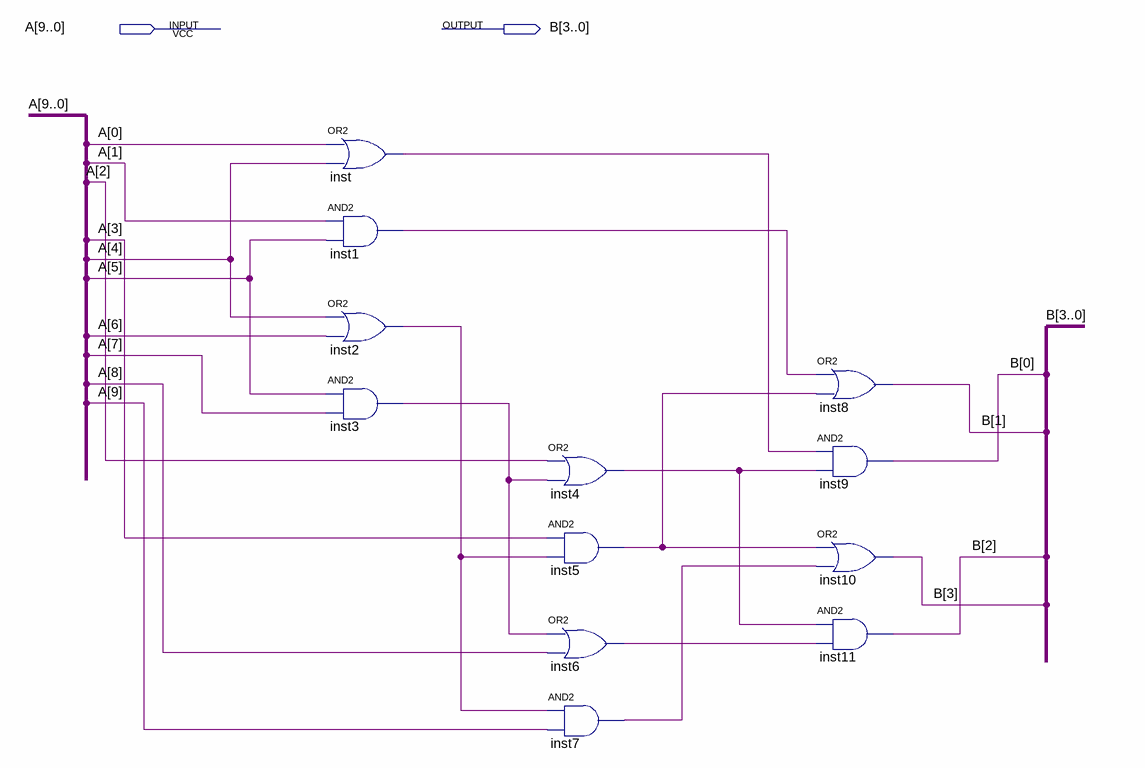
[diagram p0: schematic sheet]
// Quartus schematic And_Or_2.bdf as structural Verilog: 12 symbols, 2 pins
module And_Or_2 (
  input  [9:0] A,
  output [3:0] B
);

  wire inst1_out, inst2_out, inst3_out, inst4_out, inst5_out, inst6_out, inst7_out, inst_out;

  or inst (inst_out, A[0], A[4]);
  and inst1 (inst1_out, A[1], A[5]);
  or inst2 (inst2_out, A[4], A[6]);
  and inst3 (inst3_out, A[5], A[7]);
  or inst4 (inst4_out, A[2], inst3_out);
  and inst5 (inst5_out, A[3], inst2_out);
  or inst6 (inst6_out, inst3_out, A[8]);
  and inst7 (inst7_out, inst2_out, A[9]);
  or inst8 (B[1], inst1_out, inst5_out);
  and inst9 (B[0], inst_out, inst4_out);
  or inst10 (B[3], inst5_out, inst7_out);
  and inst11 (B[2], inst4_out, inst6_out);
endmodule
